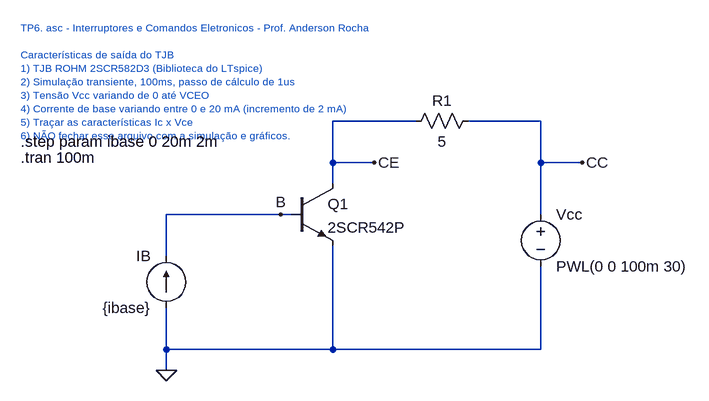
[diagram p0: schematic TP6.asc]
TP6.asc, the LTspice schematic file:
Version 4
SHEET 1 1012 680
WIRE 80 -32 -48 -32
WIRE 272 -32 160 -32
WIRE -48 32 -48 -32
WIRE 16 32 -48 32
WIRE 272 32 272 -32
WIRE 336 32 272 32
WIRE -48 64 -48 32
WIRE -128 112 -304 112
WIRE -112 112 -128 112
WIRE 272 112 272 32
WIRE -304 176 -304 112
WIRE -304 320 -304 256
WIRE -48 320 -48 160
WIRE -48 320 -304 320
WIRE 272 320 272 192
WIRE 272 320 -48 320
WIRE -304 352 -304 320
FLAG -304 352 0
FLAG -128 112 B
FLAG 16 32 CE
FLAG 336 32 CC
SYMBOL res 176 -48 R90
WINDOW 0 0 56 VBottom 2
WINDOW 3 32 56 VTop 2
SYMATTR InstName R1
SYMATTR Value 5
SYMBOL npn -112 64 R0
SYMATTR InstName Q1
SYMATTR Value 2SCR542P
SYMBOL voltage 272 96 R0
WINDOW 123 0 0 Left 0
WINDOW 39 0 0 Left 0
SYMATTR InstName Vcc
SYMATTR Value PWL(0 0 100m 30)
SYMBOL current -304 256 R180
WINDOW 0 24 80 Left 2
WINDOW 3 24 0 Left 2
WINDOW 123 0 0 Left 0
WINDOW 39 0 0 Left 0
SYMATTR InstName IB
SYMATTR Value {ibase}
TEXT -528 -176 Left 1 ;TP6. asc - Interruptores e Comandos Eletronicos - Prof. Anderson Rocha\n \nCaracterísticas de saída do TJB\n1) TJB ROHM 2SCR582D3 (Biblioteca do LTspice)\n2) Simulação transiente, 100ms, passo de cálculo de 1us\n3) Tensão Vcc variando de 0 até VCEO\n4) Corrente de base variando entre 0 e 20 mA (incremento de 2 mA)\n5) Traçar as características Ic x Vce\n6) NÃO fechar esse arquivo com a simulação e gráficos.
TEXT -528 0 Left 2 !.step param ibase 0 20m 2m
TEXT -528 24 Left 2 !.tran 100m

The netlist it stands for:
* TP6.asc
R1 CC CE 5
Q1 CE B 0 0 2SCR542P
Vcc CC 0 PWL(0 0 100m 30)
IB 0 B {ibase}
.model NPN NPN
.model PNP PNP
.lib standard.bjt
* TP6. asc - Interruptores e Comandos Eletronicos - Prof. Anderson Rocha
* Características de saída do TJB
* 1) TJB ROHM 2SCR582D3 (Biblioteca do LTspice)
* 2) Simulação transiente, 100ms, passo de cálculo de 1us
* 3) Tensão Vcc variando de 0 até VCEO
* 4) Corrente de base variando entre 0 e 20 mA (incremento de 2 mA)
* 5) Traçar as características Ic x Vce
* 6) NÃO fechar esse arquivo com a simulação e gráficos.
.step param ibase 0 20m 2m
.tran 100m
.backanno
.end